# EAGLE design W602X (EAGLE 6.6.0)
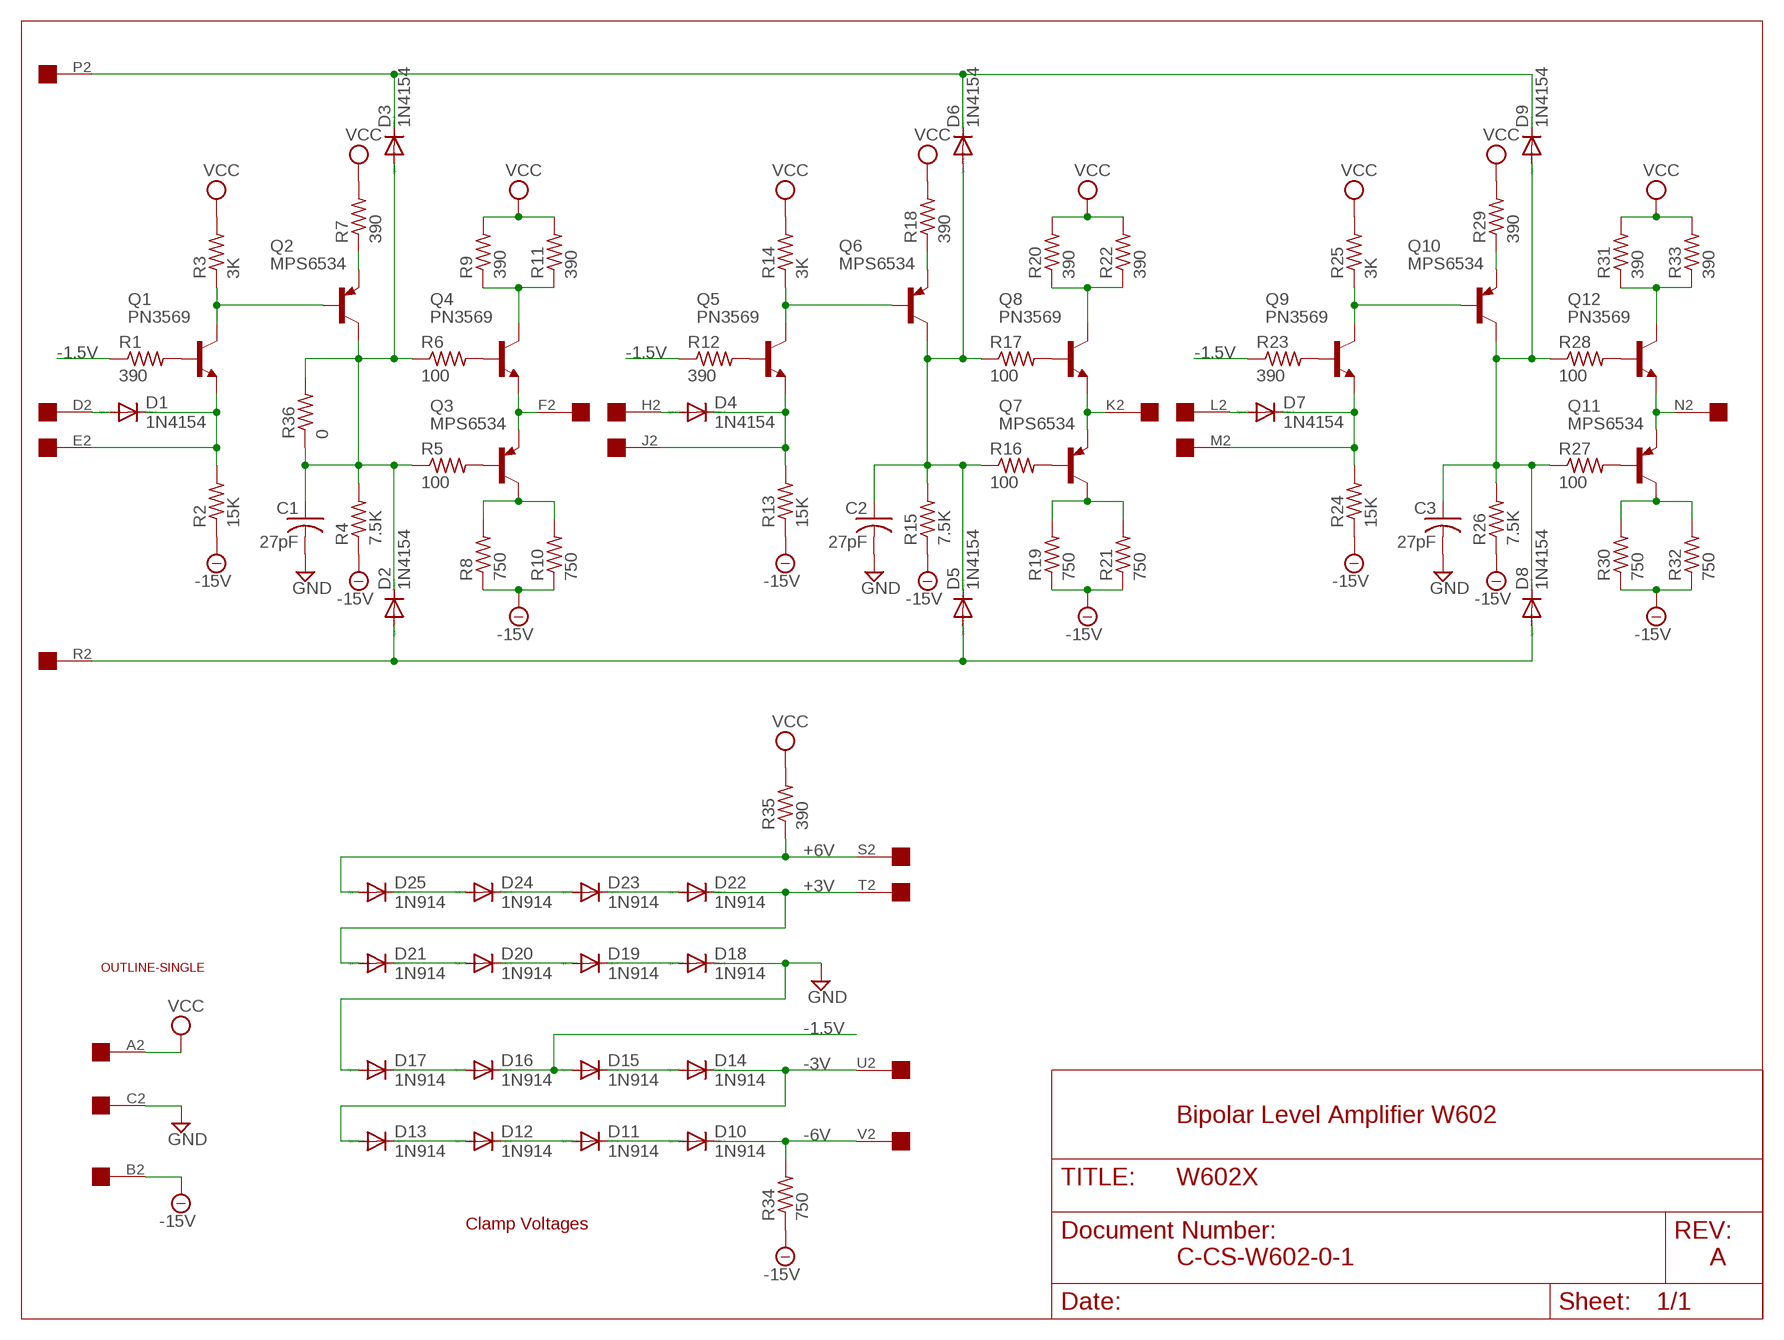
[diagram p0: schematic, sheet 1]

## Parts
C1  27pF  C-US  [C063-025X075]
C2  27pF  C-US  [C063-025X075]
C3  27pF  C-US  [C063-025X075]
D1  1N4154  DIODE-DO35-10  [DO35-10]
D2  1N4154  DIODE-DO35-10  [DO35-10]
D3  1N4154  DIODE-DO35-10  [DO35-10]
D4  1N4154  DIODE-DO35-10  [DO35-10]
D5  1N4154  DIODE-DO35-10  [DO35-10]
D6  1N4154  DIODE-DO35-10  [DO35-10]
D7  1N4154  DIODE-DO35-10  [DO35-10]
D8  1N4154  DIODE-DO35-10  [DO35-10]
D9  1N4154  DIODE-DO35-10  [DO35-10]
D10  1N914  DIODE-DO35-10  [DO35-10]
D11  1N914  DIODE-DO35-10  [DO35-10]
D12  1N914  DIODE-DO35-10  [DO35-10]
D13  1N914  DIODE-DO35-10  [DO35-10]
D14  1N914  DIODE-DO35-10  [DO35-10]
D15  1N914  DIODE-DO35-10  [DO35-10]
D16  1N914  DIODE-DO35-10  [DO35-10]
D17  1N914  DIODE-DO35-10  [DO35-10]
D18  1N914  DIODE-DO35-10  [DO35-10]
D19  1N914  DIODE-DO35-10  [DO35-10]
D20  1N914  DIODE-DO35-10  [DO35-10]
D21  1N914  DIODE-DO35-10  [DO35-10]
D22  1N914  DIODE-DO35-10  [DO35-10]
D23  1N914  DIODE-DO35-10  [DO35-10]
D24  1N914  DIODE-DO35-10  [DO35-10]
D25  1N914  DIODE-DO35-10  [DO35-10]
Q1  PN3569  -NPN-TO5  [TO5]
Q2  MPS6534  -PNP-TO5  [TO5]
Q3  MPS6534  -PNP-TO5  [TO5]
Q4  PN3569  -NPN-TO5  [TO5]
Q5  PN3569  -NPN-TO5  [TO5]
Q6  MPS6534  -PNP-TO5  [TO5]
Q7  MPS6534  -PNP-TO5  [TO5]
Q8  PN3569  -NPN-TO5  [TO5]
Q9  PN3569  -NPN-TO5  [TO5]
Q10  MPS6534  -PNP-TO5  [TO5]
Q11  MPS6534  -PNP-TO5  [TO5]
Q12  PN3569  -NPN-TO5  [TO5]
R1  390  R-US_0207/10  [0207/10]
R2  15K  R-US_0207/10  [0207/10]
R3  3K  R-US_0207/10  [0207/10]
R4  7.5K  R-US_0207/10  [0207/10]
R5  100  R-US_0207/10  [0207/10]
R6  100  R-US_0207/10  [0207/10]
R7  390  R-US_0207/10  [0207/10]
R8  750  R-US_0207/10  [0207/10]
R9  390  R-US_0207/10  [0207/10]
R10  750  R-US_0207/10  [0207/10]
R11  390  R-US_0207/10  [0207/10]
R12  390  R-US_0207/10  [0207/10]
R13  15K  R-US_0207/10  [0207/10]
R14  3K  R-US_0207/10  [0207/10]
R15  7.5K  R-US_0207/10  [0207/10]
R16  100  R-US_0207/10  [0207/10]
R17  100  R-US_0207/10  [0207/10]
R18  390  R-US_0207/10  [0207/10]
R19  750  R-US_0207/10  [0207/10]
R20  390  R-US_0207/10  [0207/10]
R21  750  R-US_0207/10  [0207/10]
R22  390  R-US_0207/10  [0207/10]
R23  390  R-US_0207/10  [0207/10]
R24  15K  R-US_0207/10  [0207/10]
R25  3K  R-US_0207/10  [0207/10]
R26  7.5K  R-US_0207/10  [0207/10]
R27  100  R-US_0207/10  [0207/10]
R28  100  R-US_0207/10  [0207/10]
R29  390  R-US_0207/10  [0207/10]
R30  750  R-US_0207/10  [0207/10]
R31  390  R-US_0207/10  [0207/10]
R32  750  R-US_0207/10  [0207/10]
R33  390  R-US_0207/10  [0207/10]
R34  750  R-US_0207/10  [0207/10]
R35  390  R-US_0207/10  [0207/10]
R36  0  R-US_0207/10  [0207/10]
U$1  OUTLINE-SINGLE  [SINGLE]
U$2  EDGE-1  [EDGE-CON1]

## Nets
+3V: D21.A D22.C U$2.T2
+6V: D25.A R35.1 U$2.S2
-1.5V: D15.A D16.C R1.1 R12.1 R23.1
-3V: D13.A D14.C U$2.U2
-6V: D10.C R34.2 U$2.V2
-15V: R2.1 R4.1 R8.1 R10.1 R13.1 R15.1 R19.1 R21.1 R24.1 R26.1 R30.1 R32.1 R34.1 U$2.B2
GND: C1.2 C2.2 C3.2 D17.A D18.C U$2.C2
N$1: Q1.3(C) Q2.2(B) R3.1
N$2: Q2.1(E) R7.1
N$3: C1.1 D2.C D3.A Q2.3(C) R4.2 R5.1 R6.1 R36.1 R36.2
N$4: Q1.2(B) R1.2
N$5: D1.C Q1.1(E) R2.2 U$2.E2
N$6: D1.A U$2.D2
N$7: Q3.3(C) R8.2 R10.2
N$8: Q3.2(B) R5.2
N$9: Q5.3(C) Q6.2(B) R14.1
N$10: Q4.2(B) R6.2
N$11: Q3.1(E) Q4.1(E) U$2.F2
N$12: Q4.3(C) R9.1 R11.1
N$13: Q6.1(E) R18.1
N$14: C2.1 D5.C D6.A Q6.3(C) R15.2 R16.1 R17.1
N$15: Q5.2(B) R12.2
N$16: D4.C Q5.1(E) R13.2 U$2.J2
N$17: D4.A U$2.H2
N$18: Q7.3(C) R19.2 R21.2
N$19: Q7.2(B) R16.2
N$20: Q8.2(B) R17.2
N$21: Q7.1(E) Q8.1(E) U$2.K2
N$22: Q8.3(C) R20.1 R22.1
N$23: Q9.3(C) Q10.2(B) R25.1
N$24: Q10.1(E) R29.1
N$25: C3.1 D8.C D9.A Q10.3(C) R26.2 R27.1 R28.1
N$26: Q9.2(B) R23.2
N$27: D7.C Q9.1(E) R24.2 U$2.M2
N$28: D7.A U$2.L2
N$29: Q11.3(C) R30.2 R32.2
N$30: Q11.2(B) R27.2
N$31: Q12.2(B) R28.2
N$32: Q11.1(E) Q12.1(E) U$2.N2
N$33: Q12.3(C) R31.1 R33.1
N$34: D2.A D5.A D8.A U$2.R2
N$35: D3.C D6.C D9.C U$2.P2
N$38: D10.A D11.C
N$39: D11.A D12.C
N$40: D12.A D13.C
N$43: D14.A D15.C
N$45: D16.A D17.C
N$48: D18.A D19.C
N$49: D19.A D20.C
N$50: D20.A D21.C
N$53: D22.A D23.C
N$54: D23.A D24.C
N$55: D24.A D25.C
VCC: R3.2 R7.2 R9.2 R11.2 R14.2 R18.2 R20.2 R22.2 R25.2 R29.2 R31.2 R33.2 R35.2 U$2.A2

## Notes on the sheet
- Bipolar Level Amplifier W602
- Clamp Voltages
- C-CS-W602-0-1 | A

## Library data of the parts
C1-C3 = dec-con:C-US: Capacitors with funky DEC lead spacing.
D1-D25 = diode:DIODE-: DIODE
Q1 Q4 Q5 Q8 Q9 Q12 = transistor:*-NPN-: NPN Transistror BF959 corrected 2008.03.06
Q2 Q3 Q6 Q7 Q10 Q11 = transistor:*-PNP-: PNP Transistror
R1-R36 = rcl:R-US_: RESISTOR, American symbol
U$1 = dec-con:OUTLINE-*: Board outlines for DEC boards.
U$2 = dec-con:EDGE-1: Single-Sided DEC Edge Connector -- (side 2)

## Board
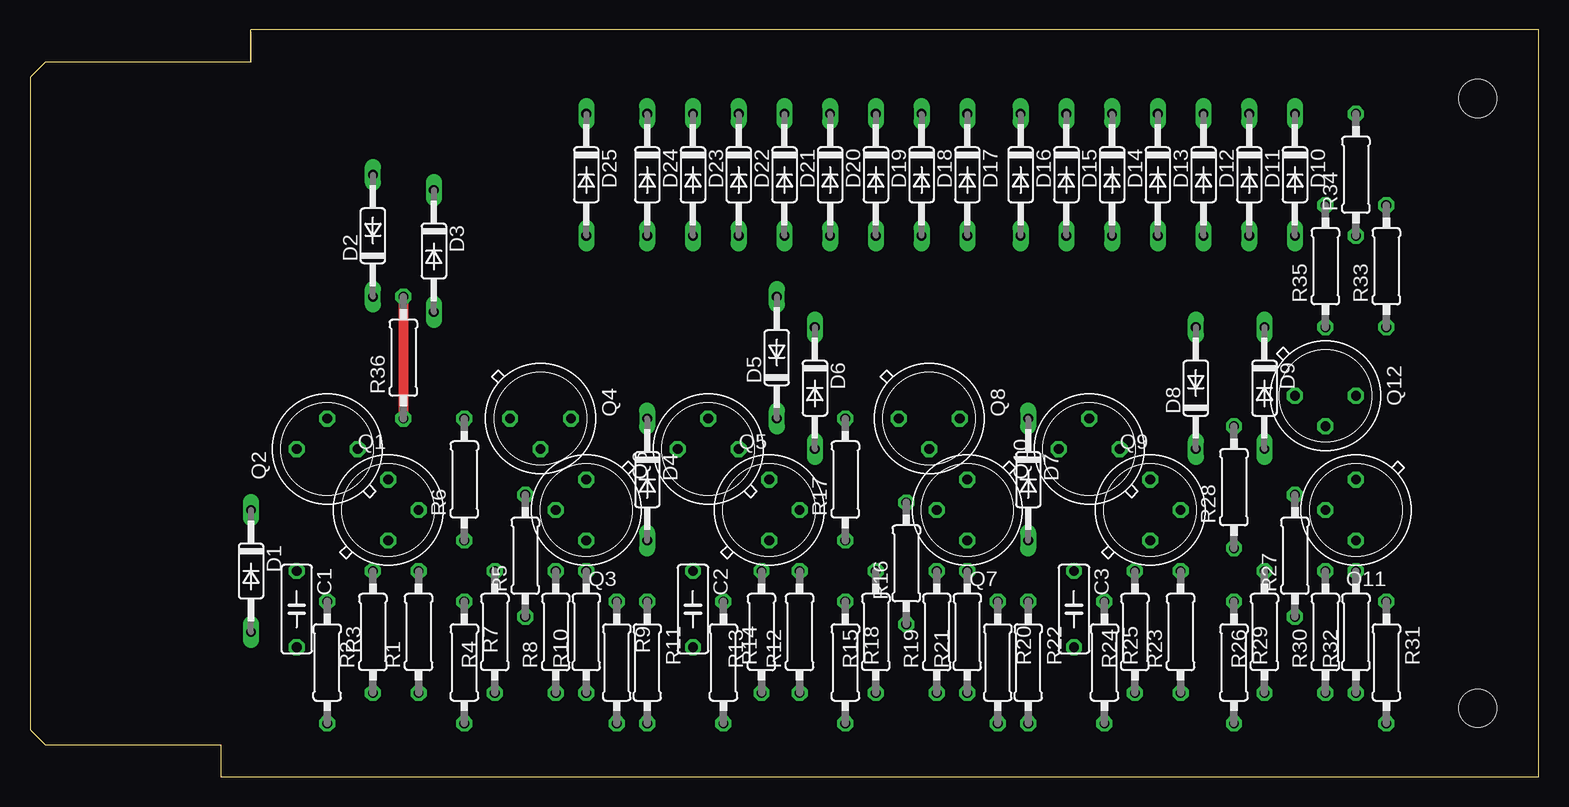
[diagram p1: board, top side]
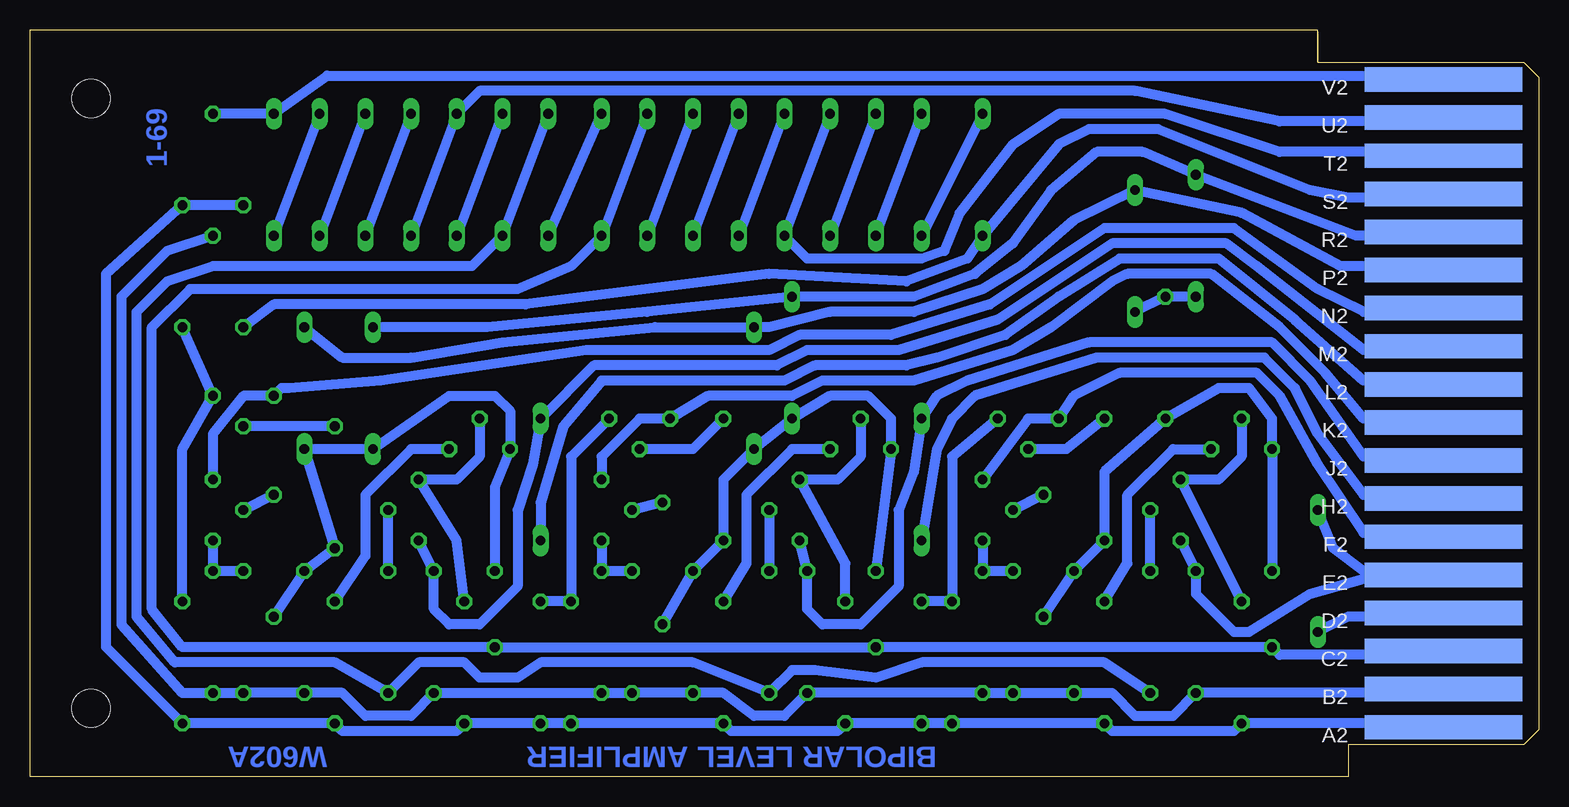
[diagram p2: board, bottom side, seen from below]

Size 125.73 x 62.23 mm. Coordinates in mm from the lower left corner, seen from the top.
Copper layers (1+16): Top 0.035mm / dielectric 1.5mm / Bottom 0.035mm
Design rules "16mils": minimum track width 16mil, minimum drill 32mil, track to track 15mil, track to pad 10mil, pad to pad 10mil, via to via 10mil, smd to smd 10mil, copper to edge 13mil, drill to drill 10mil, minimum pad ring 10mil, minimum via ring 8mil, stop-mask expansion 0mil, vias tented up to drill 0mil, thermal gap 10mil

### Footprints (pad centres in the part's own frame; a part is rotated, then mirrored left to right if it is on the bottom)
C063-025X075 = drill 0.813 octagon: 1 -2.54,0; 2 3.81,0
DO35-10 = drill 0.813 long: A 5.08,0; C -5.08,0
TO5 = drill 0.813 octagon: 1 0,-2.54; 2 2.54,0; 3 0,2.54
0207/10 = drill 0.813 octagon: 1 -5.08,0; 2 5.08,0
SINGLE = hole 3.175: 120.65,56.515; 120.65,5.715
EDGE-CON1 = smd 13.106 x 2.032 bottom: A2 7.938,4.128; B2 7.938,7.303; C2 7.938,10.477; D2 7.938,13.652; E2 7.938,16.828; F2 7.938,20.003; H2 7.938,23.177; J2 7.938,26.352; K2 7.938,29.527; L2 7.938,32.703; M2 7.938,35.877; N2 7.938,39.053; P2 7.938,42.227; R2 7.938,45.403; S2 7.938,48.578; T2 7.938,51.752; U2 7.938,54.928; V2 7.938,58.102

### Placement (x,y rotation side)
C1  22.23,14.61 270 top
C2  55.25,14.61 270 top
C3  87,14.61 270 top
D1  18.42,17.14 270 top
D2  28.58,45.09 90 top
D3  33.66,43.81 270 top
D4  51.44,24.77 270 top
D5  62.23,34.92 90 top
D6  65.41,32.38 270 top
D7  83.19,24.77 270 top
D8  97.16,32.38 90 top
D9  102.87,32.38 270 top
D10  105.41,50.16 270 top
D11  101.6,50.16 270 top
D12  97.79,50.16 270 top
D13  93.98,50.16 270 top
D14  90.17,50.16 270 top
D15  86.36,50.16 270 top
D16  82.55,50.16 270 top
D17  78.11,50.16 270 top
D18  74.3,50.16 270 top
D19  70.49,50.16 270 top
D20  66.68,50.16 270 top
D21  62.87,50.16 270 top
D22  59.06,50.16 270 top
D23  55.25,50.16 270 top
D24  51.44,50.16 270 top
D25  46.36,50.16 270 top
Q1  29.85,22.23 0 top
Q2  24.77,27.3 90 top
Q3  46.36,22.23 180 top
Q4  42.55,29.84 270 top
Q5  61.6,22.23 0 top
Q6  56.52,27.3 90 top
Q7  78.11,22.23 180 top
Q8  74.93,29.84 270 top
Q9  93.35,22.23 0 top
Q10  88.27,27.3 90 top
Q11  110.49,22.23 180 top
Q12  107.95,31.75 270 top
R1  32.39,12.06 90 top
R2  28.58,12.06 90 top
R3  24.77,9.53 270 top
R4  38.74,12.06 90 top
R5  41.28,18.41 90 top
R6  36.2,24.77 90 top
R7  36.2,9.53 270 top
R8  43.82,12.06 90 top
R9  48.9,9.53 270 top
R10  46.36,12.06 90 top
R11  51.44,9.53 270 top
R12  64.14,12.06 90 top
R13  60.96,12.06 90 top
R14  57.79,9.53 270 top
R15  70.49,12.06 90 top
R16  73.03,17.78 90 top
R17  67.95,24.77 90 top
R18  67.95,9.53 270 top
R19  75.57,12.06 90 top
R20  80.65,9.53 270 top
R21  78.11,12.06 90 top
R22  83.19,9.53 270 top
R23  95.89,12.06 90 top
R24  92.08,12.06 90 top
R25  89.54,9.53 270 top
R26  102.87,12.06 90 top
R27  105.41,18.41 90 top
R28  100.33,24.13 90 top
R29  100.33,9.53 270 top
R30  107.95,12.06 90 top
R31  113.03,9.53 270 top
R32  110.49,12.06 90 top
R33  113.03,42.55 90 top
R34  110.49,50.16 90 top
R35  107.95,42.55 90 top
R36  31.12,34.92 90 top
U$1  0,0 0 top
U$2  0,0 0 top

### Tracks (layer width: path | path; a pad name or v marks a point on that pad's centre or on a via)
+3V
  Bottom 0.813: D22.C D21.A 60.96,43.18 51.44,43.18 49.53,43.81 48.26,46.99 43.82,52.7 40.01,55.24 31.12,55.24 21.59,52.07 8.89,52.07 U$2.T2
+6V
  Bottom 0.813: U$2.S2 8.89,48.26 15.88,48.26 19.05,48.9 31.75,53.98 37.47,53.98 40.01,52.7 D25.A 47.63,43.18 52.71,41.27 64.14,41.91 84.46,39.37 105.41,39.37 R35.1
-1.5V
  Bottom 0.813: R1.1 36.2,9.53 51.44,9.53 55.25,8.26 60.33,8.89 62.23,8.89 R12.1 70.49,9.53 83.19,9.53 85.09,8.26 88.27,8.26 89.54,9.53 93.35,9.53 R23.1 100.33,9.53 113.67,9.53 116.84,13.34 116.84,38.73 114.3,41.27 110.49,42.55 88.9,42.55 D15.A D16.C
-3V
  Bottom 0.813: U$2.U2 8.89,54.61 21.59,54.61 33.66,57.15 88.27,57.15 D14.C D13.A
-6V
  Bottom 0.813: R34.2 D10.C 100.97,58.42 8.89,58.42 U$2.V2
-15V
  Bottom 0.813: U$2.B2 8.26,6.99 R2.1 30.48,5.08 33.66,5.08 35.56,6.99 R4.1 R8.1 R10.1 R13.1 62.87,5.08 65.41,5.08 67.95,6.99 R15.1 R19.1 R21.1 R24.1 93.98,5.08 97.79,5.08 99.7,6.99 R26.1 R30.1 R32.1 113.03,6.99 118.11,12.7 118.11,40.01 114.3,43.81 R34.1
GND
  Bottom 0.813: U$2.C2 8.89,10.16 21.59,10.16 C1.2 C2.2 C3.2 113.03,10.79 115.57,13.97 115.57,37.47 112.4,40.64 85.09,40.64 80.65,42.55 D17.A D18.C
N$1
  Bottom 0.813: R3.1 Q1.3 26.67,24.77 24.77,26.67 Q2.2
N$2
  Bottom 0.813: R7.1 34.29,17.78 34.29,23.5 30.48,27.3 Q2.1
N$3
  Top 0.813: R36.2 R36.1
  Bottom 0.813: C1.1 Q2.3 22.23,29.84 24.13,32.38 26.67,32.38 R36.1 36.2,25.4 R6.1 R4.2 R5.1 | D2.C R36.2 D3.A
N$4
  Bottom 0.813: R1.2 Q1.2
N$5
  Bottom 0.813: U$2.E2 8.7,17.08 | 8.7,17.08 8.89,17.14 14.61,17.14 17.15,19.05 D1.C | 8.7,17.08 8.89,16.51 14.61,16.51 19.05,15.24 24.13,12.06 25.4,12.06 28.58,15.24 R2.2 Q1.1
N$6
  Bottom 0.813: U$2.D2 8.89,13.34 15.88,13.34 D1.A
N$7
  Bottom 0.813: R8.2 R10.2 Q3.3
N$8
  Bottom 0.813: R5.2 Q3.2
N$9
  Bottom 0.813: R14.1 57.79,17.78 Q5.3 58.42,24.77 56.52,26.67 Q6.2
N$10
  Bottom 0.813: R6.2 39.37,27.3 Q4.2
N$11
  Bottom 0.813: Q3.1 42.55,29.84 Q4.1 38.74,31.75 34.93,33.66 23.5,33.66 21.59,31.75 18.42,26.04 14.61,20.32 8.89,20.32 U$2.F2
N$12
  Bottom 0.813: Q4.3 48.9,26.67 R9.1 R11.1
N$13
  Bottom 0.813: Q6.1 62.23,27.3 66.04,23.5 66.04,17.78 R18.1
N$14
  Bottom 0.813: C2.1 Q6.3 53.98,29.84 55.88,31.75 59.06,31.75 D5.C D6.A 67.95,24.77 R17.1 R15.2 R16.1
N$15
  Bottom 0.813: Q5.2 R12.2
N$16
  Bottom 0.813: U$2.J2 8.26,26.67 14.61,26.67 19.05,33.02 22.23,36.2 37.47,36.2 47.63,33.02 50.17,31.75 D4.C 52.07,25.4 53.34,22.23 53.34,15.88 56.52,12.7 59.69,12.7 60.96,13.97 R13.2 Q5.1
N$17
  Bottom 0.813: U$2.H2 8.26,23.5 14.61,23.5 18.42,28.57 20.32,32.38 22.86,34.92 36.83,34.92 46.99,31.75 48.9,29.84 50.17,27.3 D4.A
N$18
  Bottom 0.813: R19.2 R21.2 Q7.3
N$19
  Bottom 0.813: R16.2 Q7.2
N$20
  Bottom 0.813: R17.2 70.49,27.3 Q8.2
N$21
  Bottom 0.813: U$2.K2 8.89,29.84 14.61,29.84 17.78,33.66 21.59,37.47 27.31,41.91 34.29,41.91 35.56,41.27 40.64,37.47 43.82,35.56 52.07,33.02 59.69,33.02 62.23,31.75 69.22,31.75 Q8.1 74.93,29.84 78.11,26.67 Q7.1
N$22
  Bottom 0.813: Q8.3 80.65,26.67 R20.1 R22.1
N$23
  Bottom 0.813: Q10.2 88.27,26.67 90.17,24.77 Q9.3 90.17,19.68 R25.1
N$24
  Bottom 0.813: Q10.1 93.98,27.3 97.79,23.5 97.79,18.41 R29.1
N$25
  Bottom 0.813: C3.1 87,24.13 Q10.3 85.73,30.48 87,31.75 90.81,31.75 D8.C D9.A R28.1 R26.2 R27.1
N$26
  Bottom 0.813: R23.2 Q9.2
N$27
  Bottom 0.813: U$2.M2 8.89,35.56 14.61,35.56 23.5,42.55 26.04,44.45 35.56,44.45 45.09,38.1 53.34,35.56 60.96,35.56 63.5,34.29 78.74,34.29 D7.C 83.82,26.04 85.09,22.23 85.09,15.88 88.27,12.7 90.81,12.7 92.08,13.97 R24.2 Q9.1
N$28
  Bottom 0.813: U$2.L2 8.26,33.02 14.61,33.02 20.32,38.1 26.67,43.18 34.93,43.18 40.01,40.01 44.45,36.83 50.17,34.92 52.71,34.29 60.33,34.29 62.87,33.02 78.11,33.02 81.28,29.21 83.19,22.86 D7.A
N$29
  Bottom 0.813: R30.2 R32.2 Q11.3
N$30
  Bottom 0.813: R27.2 Q11.2
N$31
  Bottom 0.813: R28.2 Q12.2
N$32
  Bottom 0.813: U$2.N2 8.89,38.73 14.61,38.73 18.42,40.64 25.4,45.72 36.2,45.72 45.72,39.37 53.98,36.83 61.6,36.83 64.14,35.56 79.38,35.56 96.52,33.02 104.14,32.38 104.78,32.38 Q12.1 107.95,31.75 110.49,28.57 Q11.1
N$33
  Bottom 0.813: R33.1 Q12.3 113.03,27.3 R31.1
N$34
  Bottom 0.813: U$2.R2 8.89,45.09 15.24,45.09 D2.A 33.02,52.07 36.83,52.07 40.64,48.9 43.82,44.45 46.99,41.91 52.07,40.01 D5.A 74.3,38.73 87.63,37.47 D8.A
N$35
  Bottom 0.813: U$2.P2 8.89,42.55 16.51,42.55 24.77,46.99 D3.C 38.74,46.35 43.18,42.55 46.36,40.64 52.07,38.73 59.06,38.73 64.14,37.47 D6.C 73.66,37.47 86.36,36.2 93.98,34.92 99.7,34.92 D9.C
N$38
  Bottom 0.813: D11.C D10.A
N$39
  Bottom 0.813: D12.C D11.A
N$40
  Bottom 0.813: D13.C D12.A
N$43
  Bottom 0.813: D15.C D14.A
N$45
  Bottom 0.813: D16.A D17.C
N$48
  Bottom 0.813: D19.C D18.A
N$49
  Bottom 0.813: D20.C D19.A
N$50
  Bottom 0.813: D21.C D20.A
N$53
  Bottom 0.813: D23.C D22.A
N$54
  Bottom 0.813: D23.A D24.C
N$55
  Bottom 0.813: D25.C D24.A
VCC
  Bottom 0.813: U$2.A2 8.26,4.13 8.26,4.45 R3.2 25.4,3.81 35.56,3.81 R7.2 R9.2 R11.2 R14.2 58.42,3.81 67.31,3.81 R18.2 R20.2 R22.2 R25.2 90.17,3.81 99.7,3.81 R29.2 R31.2 119.38,10.79 119.38,41.91 R33.2 R35.2

### Text on the board
Bottom: 1-69 | BIPOLAR LEVEL AMPLIFIER | W602A
200bmp: C:/Users/Vince/Documents/eagle/projects/DEC/Wxxx/W602/W602Abackfb.bmp